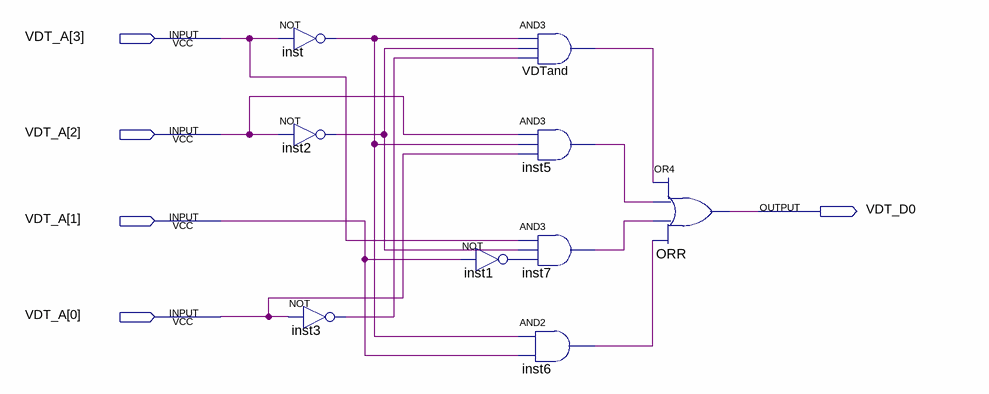
[diagram p0: schematic sheet]
// Quartus schematic D0.bdf as structural Verilog: 9 symbols, 5 pins
module D0 (
  input  [3:0] VDT_A,
  output VDT_D0
);

  wire inst1_out, inst2_out, inst3_out, inst5_out, inst6_out, inst7_out, inst_out, VDTand_out;

  not inst (inst_out, VDT_A[3]);
  not inst2 (inst2_out, VDT_A[2]);
  not inst3 (inst3_out, VDT_A[0]);
  not inst1 (inst1_out, VDT_A[1]);
  and VDTand (VDTand_out, inst_out, inst2_out, inst3_out);
  and inst5 (inst5_out, VDT_A[2], inst_out, VDT_A[0]);
  and inst7 (inst7_out, VDT_A[3], inst2_out, inst1_out);
  and inst6 (inst6_out, inst_out, VDT_A[1]);
  or ORR (VDT_D0, VDTand_out, inst5_out, inst7_out, inst6_out);
endmodule
